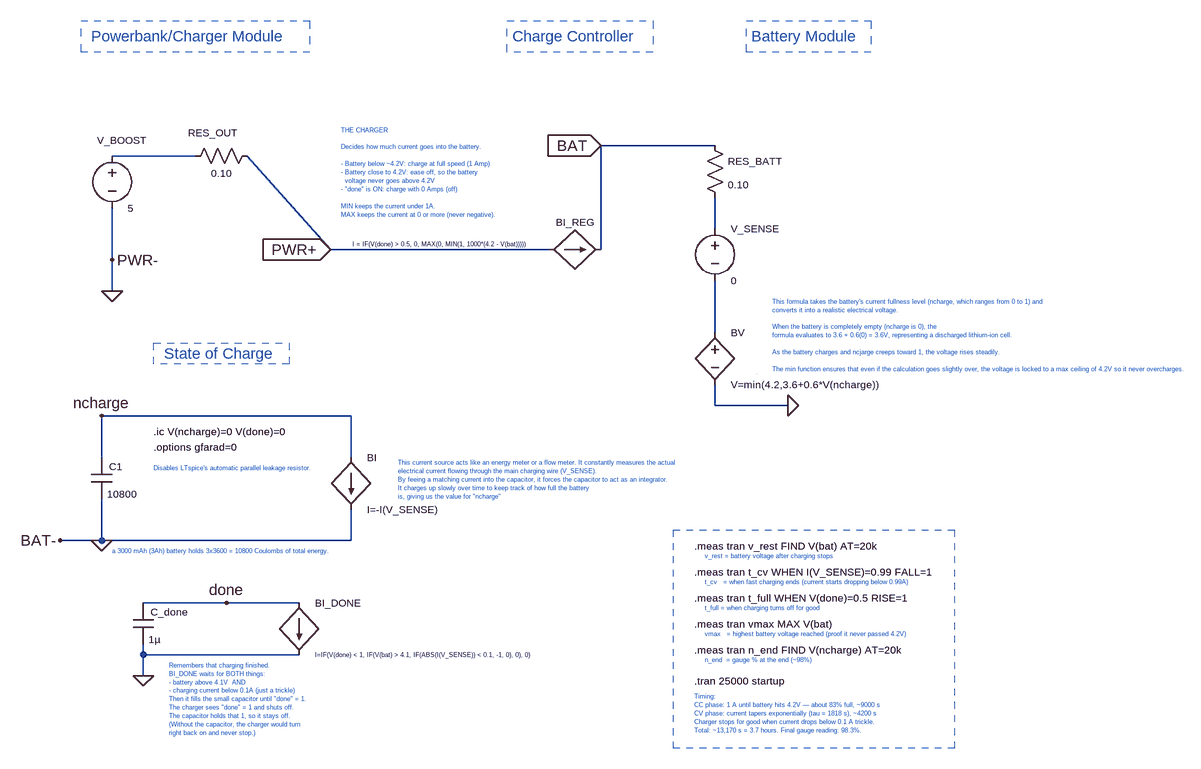
[diagram p0: schematic CCVC_Final.asc]
CCVC_Final.asc, the LTspice schematic file:
Version 4.1
SHEET 1 3380 1552
WIRE 976 144 800 144
WIRE 176 160 48 160
WIRE 976 272 976 224
WIRE 384 304 256 160
WIRE 720 304 384 304
WIRE 800 304 800 144
WIRE 48 320 48 240
WIRE 48 368 48 320
WIRE 976 432 976 352
WIRE 976 544 976 512
WIRE 1088 544 976 544
WIRE 416 560 32 560
WIRE 32 624 32 560
WIRE 416 624 416 560
WIRE 32 752 32 688
WIRE 32 752 -32 752
WIRE 416 752 416 704
WIRE 416 752 32 752
WIRE 224 848 96 848
WIRE 336 848 224 848
WIRE 96 928 96 912
WIRE 336 928 96 928
WIRE 96 960 96 928
FLAG 384 304 PWR+
IOPIN 384 304 In
FLAG 48 368 0
FLAG 48 320 PWR-
FLAG 800 144 BAT
IOPIN 800 144 In
FLAG 32 560 ncharge
FLAG 32 752 0
FLAG -32 752 BAT-
FLAG 1088 544 0
FLAG 96 960 0
FLAG 224 848 done
SYMBOL voltage 48 144 R0
WINDOW 0 15 2 Bottom 1
WINDOW 3 24 96 Left 1
SYMATTR InstName V_BOOST
SYMATTR Value 5
SYMBOL res 272 144 R90
WINDOW 0 -9 69 VBottom 1
WINDOW 3 32 56 VTop 1
SYMATTR InstName RES_OUT
SYMATTR Value 0.10
SYMBOL bv 976 416 R0
WINDOW 0 24 16 Left 1
WINDOW 3 24 96 Left 1
SYMATTR InstName BV
SYMATTR Value V=min(4.2,3.6+0.6*V(ncharge))
SYMBOL res 960 128 R0
WINDOW 0 36 40 Left 1
WINDOW 3 36 76 Left 1
SYMATTR InstName RES_BATT
SYMATTR Value 0.10
SYMBOL cap 16 624 R0
WINDOW 0 27 14 Left 1
WINDOW 3 24 56 Left 1
SYMATTR InstName C1
SYMATTR Value 10800
SYMBOL bi 416 624 R0
WINDOW 0 24 0 Left 1
WINDOW 3 24 80 Left 1
SYMATTR InstName BI
SYMATTR Value I=-I(V_SENSE)
SYMBOL voltage 976 256 R0
WINDOW 0 24 16 Left 1
WINDOW 3 24 96 Left 1
SYMATTR InstName V_SENSE
SYMATTR Value 0
SYMBOL bi 720 304 R270
WINDOW 0 32 40 VTop 1
WINDOW 3 15 -168 VBottom 0
SYMATTR InstName BI_REG
SYMATTR Value I = IF(V(done) > 0.5, 0, MAX(0, MIN(1, 1000*(4.2 - V(bat)))))
SYMBOL cap 80 848 R0
WINDOW 0 27 14 Left 1
WINDOW 3 24 56 Left 1
SYMATTR InstName C_done
SYMATTR Value 1µ
SYMBOL bi 336 848 R0
WINDOW 3 24 80 Left 0
WINDOW 0 24 0 Left 1
SYMATTR Value I=IF(V(done) < 1, IF(V(bat) > 4.1, IF(ABS(I(V_SENSE)) < 0.1, -1, 0), 0), 0)
SYMATTR InstName BI_DONE
TEXT 112 584 Left 1 !.ic V(ncharge)=0 V(done)=0
TEXT 128 464 Left 2 ;State of Charge
TEXT 944 968 Left 1 !.tran 25000 startup
TEXT 48 768 Left 0 ;a 3000 mAh (3Ah) battery holds 3x3600 = 10800 Coulombs of total energy.
TEXT 944 992 Left 0 ;Timing:\nCC phase: 1 A until battery hits 4.2V — about 83% full, ~9000 s\nCV phase: current tapers exponentially (tau = 1818 s), ~4200 s\nCharger stops for good when current drops below 0.1 A trickle.\nTotal: ~13,170 s = 3.7 hours. Final gauge reading: 98.3%.
TEXT 488 632 Left 0 ;This current source acts like an energy meter or a flow meter. It constantly measures the actual\nelectrical current flowing through the main charging wire (V_SENSE).\nBy feeing a matching current into the capacitor, it forces the capacitor to act as an integrator.\nIt charges up slowly over time to keep track of how full the battery\nis, giving us the value for "ncharge"
TEXT 112 608 Left 1 !.options gfarad=0
TEXT 112 640 Left 0 ;Disables LTspice's automatic parallel leakage resistor.
TEXT 1064 384 Left 0 ;This formula takes the battery's current fullness level (ncharge, which ranges from 0 to 1) and\nconverts it into a realistic electrical voltage.\n \nWhen the battery is completely empty (ncharge is 0), the\nformula evaluates to 3.6 + 0.6(0) = 3.6V, representing a discharged lithium-ion cell.\n \nAs the battery charges and ncjarge creeps toward 1, the voltage rises steadily.\n \nThe min function ensures that even if the calculation goes slightly over, the voltage is locked to a max ceiling of 4.2V so it never overcharges.
TEXT 944 800 Left 1 !.meas tran t_cv WHEN I(V_SENSE)=0.99 FALL=1
TEXT 944 840 Left 1 !.meas tran t_full WHEN V(done)=0.5 RISE=1
TEXT 944 880 Left 1 !.meas tran vmax MAX V(bat)
TEXT 944 920 Left 1 !.meas tran n_end FIND V(ncharge) AT=20k
TEXT 944 760 Left 1 !.meas tran v_rest FIND V(bat) AT=20k
TEXT 400 120 Left 0 ;THE CHARGER\n \nDecides how much current goes into the battery.\n \n- Battery below ~4.2V: charge at full speed (1 Amp)\n- Battery close to 4.2V: ease off, so the battery\n  voltage never goes above 4.2V\n- "done" is ON: charge with 0 Amps (off)\n \nMIN keeps the current under 1A.\nMAX keeps the current at 0 or more (never negative).
TEXT 136 944 Left 0 ;Remembers that charging finished.\nBI_DONE waits for BOTH things:\n- battery above 4.1V  AND\n- charging current below 0.1A (just a trickle)\nThen it fills the small capacitor until "done" = 1.\nThe charger sees "done" = 1 and shuts off.\nThe capacitor holds that 1, so it stays off.\n(Without the capacitor, the charger would turn\nright back on and never stop.)
TEXT 960 936 Left 0 ;n_end  = gauge % at the end (~98%)
TEXT 16 -24 Left 2 ;Powerbank/Charger Module
TEXT 664 -24 Left 2 ;Charge Controller
TEXT 1032 -24 Left 2 ;Battery Module
TEXT 960 816 Left 0 ;t_cv   = when fast charging ends (current starts dropping below 0.99A)
TEXT 960 856 Left 0 ;t_full = when charging turns off for good
TEXT 960 896 Left 0 ;vmax   = highest battery voltage reached (proof it never passed 4.2V)
TEXT 960 776 Left 0 ;v_rest = battery voltage after charging stops
LINE Normal 1040 496 1040 496 2
RECTANGLE Normal 352 0 0 -48 2
RECTANGLE Normal 880 0 656 -48 2
RECTANGLE Normal 1216 0 1024 -48 2
RECTANGLE Normal 320 480 112 448 2
RECTANGLE Normal 1344 1072 912 736 2

The netlist it stands for:
* CCVC_Final.asc
V_BOOST N001 0 5
RES_OUT PWR+ N001 0.10
BV N003 0 V=min(4.2,3.6+0.6*V(ncharge))
RES_BATT BAT N002 0.10
C1 ncharge 0 10800
BI ncharge 0 I=-I(V_SENSE)
V_SENSE N002 N003 0
BI_REG PWR+ BAT I = IF(V(done) > 0.5, 0, MAX(0, MIN(1, 1000*(4.2 - V(bat)))))
C_done done 0 1µ
BI_DONE done 0 I=IF(V(done) < 1, IF(V(bat) > 4.1, IF(ABS(I(V_SENSE)) < 0.1, -1, 0), 0), 0)
.ic V(ncharge)=0 V(done)=0
* State of Charge
.tran 25000 startup
* a 3000 mAh (3Ah) battery holds 3x3600 = 10800 Coulombs of total energy.
* Timing:
* CC phase: 1 A until battery hits 4.2V — about 83% full, ~9000 s
* CV phase: current tapers exponentially (tau = 1818 s), ~4200 s
* Charger stops for good when current drops below 0.1 A trickle.
* Total: ~13,170 s = 3.7 hours. Final gauge reading: 98.3%.
* This current source acts like an energy meter or a flow meter. It constantly measures the actual
* electrical current flowing through the main charging wire (V_SENSE).
* By feeing a matching current into the capacitor, it forces the capacitor to act as an integrator.
* It charges up slowly over time to keep track of how full the battery
* is, giving us the value for "ncharge"
.options gfarad=0
* Disables LTspice's automatic parallel leakage resistor.
* This formula takes the battery's current fullness level (ncharge, which ranges from 0 to 1) and
* converts it into a realistic electrical voltage.
* When the battery is completely empty (ncharge is 0), the
* formula evaluates to 3.6 + 0.6(0) = 3.6V, representing a discharged lithium-ion cell.
* As the battery charges and ncjarge creeps toward 1, the voltage rises steadily.
* The min function ensures that even if the calculation goes slightly over, the voltage is locked to a max ceiling of 4.2V so it never overcharges.
.meas tran t_cv WHEN I(V_SENSE)=0.99 FALL=1
.meas tran t_full WHEN V(done)=0.5 RISE=1
.meas tran vmax MAX V(bat)
.meas tran n_end FIND V(ncharge) AT=20k
.meas tran v_rest FIND V(bat) AT=20k
* THE CHARGER
* Decides how much current goes into the battery.
* - Battery below ~4.2V: charge at full speed (1 Amp)
* - Battery close to 4.2V: ease off, so the battery
*   voltage never goes above 4.2V
* - "done" is ON: charge with 0 Amps (off)
* MIN keeps the current under 1A.
* MAX keeps the current at 0 or more (never negative).
* Remembers that charging finished.
* BI_DONE waits for BOTH things:
* - battery above 4.1V  AND
* - charging current below 0.1A (just a trickle)
* Then it fills the small capacitor until "done" = 1.
* The charger sees "done" = 1 and shuts off.
* The capacitor holds that 1, so it stays off.
* (Without the capacitor, the charger would turn
* right back on and never stop.)
* n_end  = gauge % at the end (~98%)
* Powerbank/Charger Module
* Charge Controller
* Battery Module
* t_cv   = when fast charging ends (current starts dropping below 0.99A)
* t_full = when charging turns off for good
* vmax   = highest battery voltage reached (proof it never passed 4.2V)
* v_rest = battery voltage after charging stops
.backanno
.end